# Altium schematic sheet MAIN.SchDoc
size A3; SheetNumber: 1; SheetTotal: 11
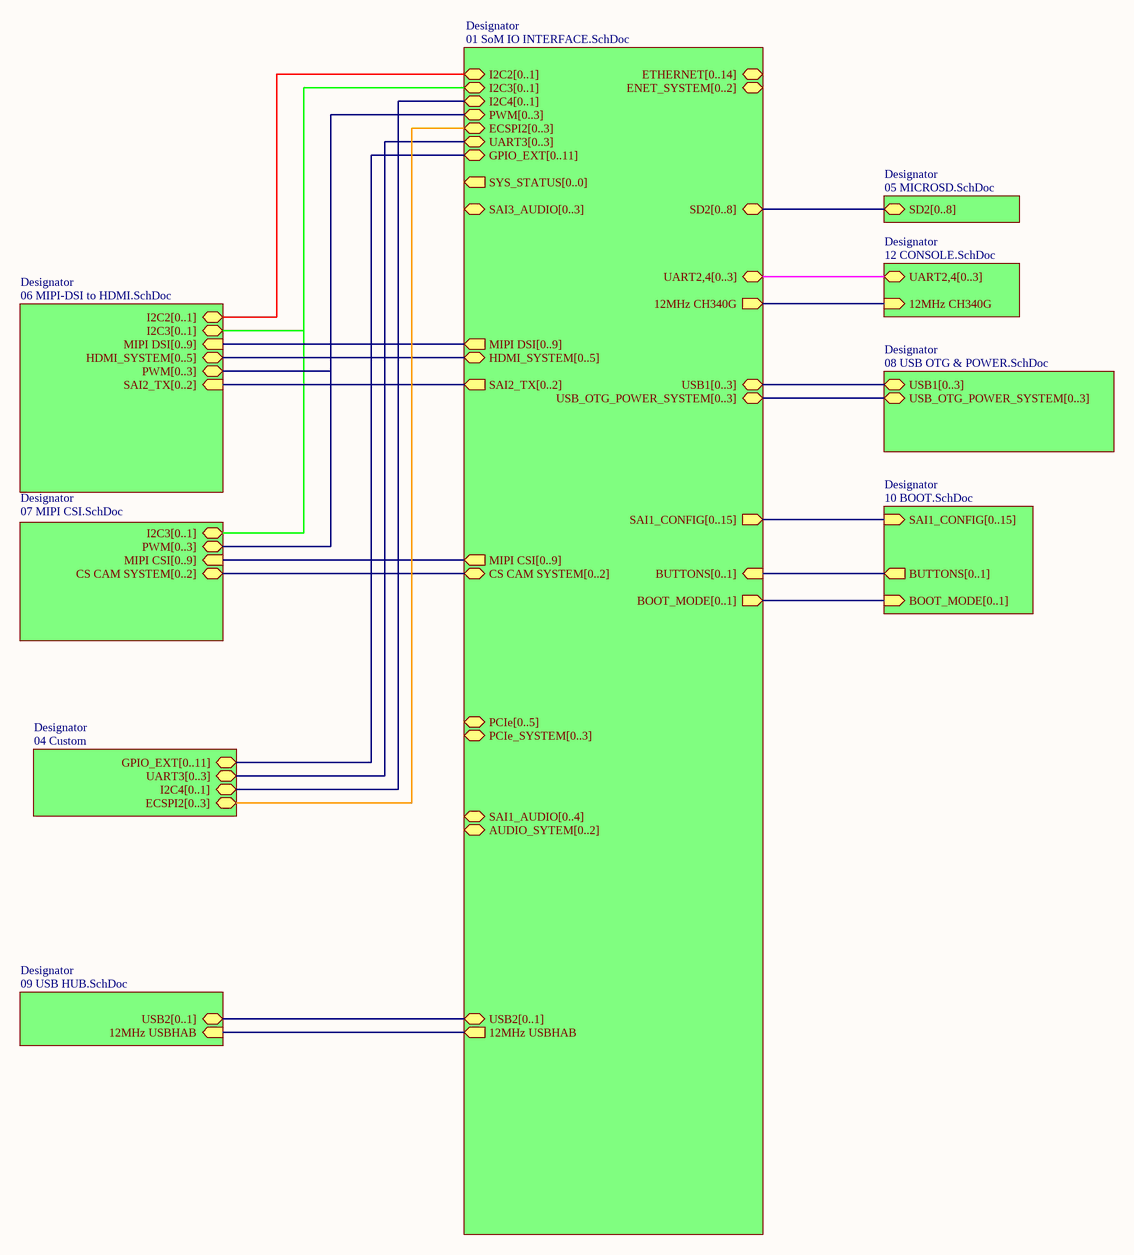
[diagram p0: MAIN.SchDoc]

## Sub-sheets
Designator = 01 SoM IO INTERFACE.SchDoc: 12MHz USBHAB (out), UART2,4[0..3] (bidir), SD2[0..8] (bidir), ETHERNET[0..14] (bidir), USB2[0..1] (bidir), MIPI DSI[0..9] (out), SAI2_TX[0..2] (out), SAI1_AUDIO[0..4] (bidir), GPIO_EXT[0..11] (bidir), MIPI CSI[0..9] (out), ECSPI2[0..3] (bidir), PCIe_SYSTEM[0..3] (bidir), PCIe[0..5] (bidir), UART3[0..3] (bidir), 12MHz CH340G (out), USB1[0..3] (bidir), SAI1_CONFIG[0..15] (out), AUDIO_SYTEM[0..2] (bidir), HDMI_SYSTEM[0..5] (bidir), CS CAM SYSTEM[0..2] (bidir), ENET_SYSTEM[0..2] (bidir), USB_OTG_POWER_SYSTEM[0..3] (bidir), I2C4[0..1] (bidir), I2C2[0..1] (bidir), I2C3[0..1] (bidir), BUTTONS[0..1] (in), SYS_STATUS[0..0] (out), BOOT_MODE[0..1] (out), SAI3_AUDIO[0..3] (bidir), PWM[0..3] (bidir)
Designator = 07 MIPI CSI.SchDoc: MIPI CSI[0..9] (in), I2C3[0..1] (bidir), CS CAM SYSTEM[0..2] (bidir), PWM[0..3] (bidir)
Designator = 08 USB OTG & POWER.SchDoc: USB1[0..3] (bidir), USB_OTG_POWER_SYSTEM[0..3] (bidir)
Designator = 10 BOOT.SchDoc: SAI1_CONFIG[0..15] (in), BUTTONS[0..1] (out), BOOT_MODE[0..1] (in)
Designator = 05 MICROSD.SchDoc: SD2[0..8] (bidir)
Designator = 06 MIPI-DSI to HDMI.SchDoc: SAI2_TX[0..2] (in), I2C3[0..1] (bidir), I2C2[0..1] (bidir), MIPI DSI[0..9] (in), HDMI_SYSTEM[0..5] (bidir), PWM[0..3] (bidir)
Designator = 12 CONSOLE.SchDoc: 12MHz CH340G (in), UART2,4[0..3] (bidir)
Designator = 04 Custom: GPIO_EXT[0..11] (bidir), UART3[0..3] (bidir), I2C4[0..1] (bidir), ECSPI2[0..3] (bidir)
Designator = 09 USB HUB.SchDoc: USB2[0..1] (bidir), 12MHz USBHAB (in)

## Nets
(unnamed): sheet Designator/12MHz USBHAB, sheet Designator/12MHz USBHAB
(unnamed): sheet Designator/12MHz CH340G, sheet Designator/12MHz CH340G

## Notes on the sheet
- Sheet Title:
- Inventron
- Size:
- Drawn By:
- Revision:
- Project:
- Checked By:
- A4
- Sheet
- of
- Budotek Teknopark
- Dudullu OSB
- Des 2. Cadde No:8/30
- Umraniye / ISTANBUL
- Electronics and Software
- Date:
- Time:
- ©2020 Inventron Electronics and Software. All rights reserved.